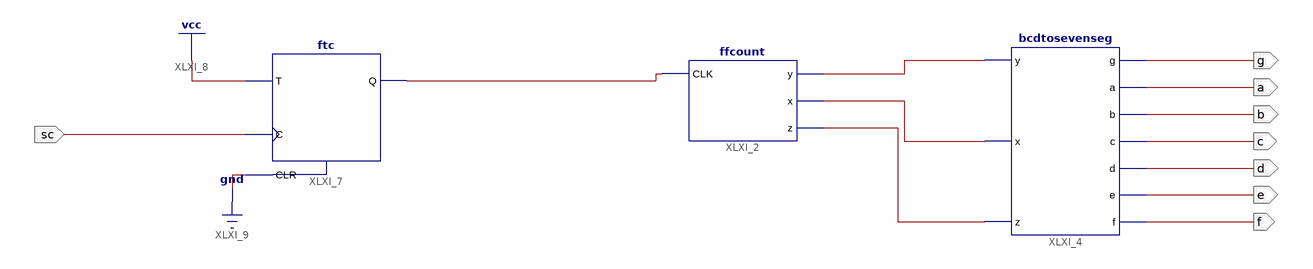
[diagram p0: schematic sheet 1]
// Xilinx ISE schematic main.sch (spartan6) as structural Verilog: 3 symbols, 8 ports
module main (
  input  sc,
  output g,
  output a,
  output b,
  output c,
  output d,
  output e,
  output f
);

  wire sw, XLXN_3, XLXN_4, XLXN_5;

  ffcount XLXI_2 (.CLK(sw), .y(XLXN_3), .x(XLXN_4), .z(XLXN_5));
  bcdtosevenseg XLXI_4 (.y(XLXN_3), .x(XLXN_4), .z(XLXN_5), .g(g), .a(a), .b(b), .c(c), .d(d), .e(e), .f(f));
  ftc XLXI_7 (.C(sc), .CLR(1'b0), .T(1'b1), .Q(sw));
endmodule
